# EAGLE design HarvestRing (EAGLE 6.5.0)
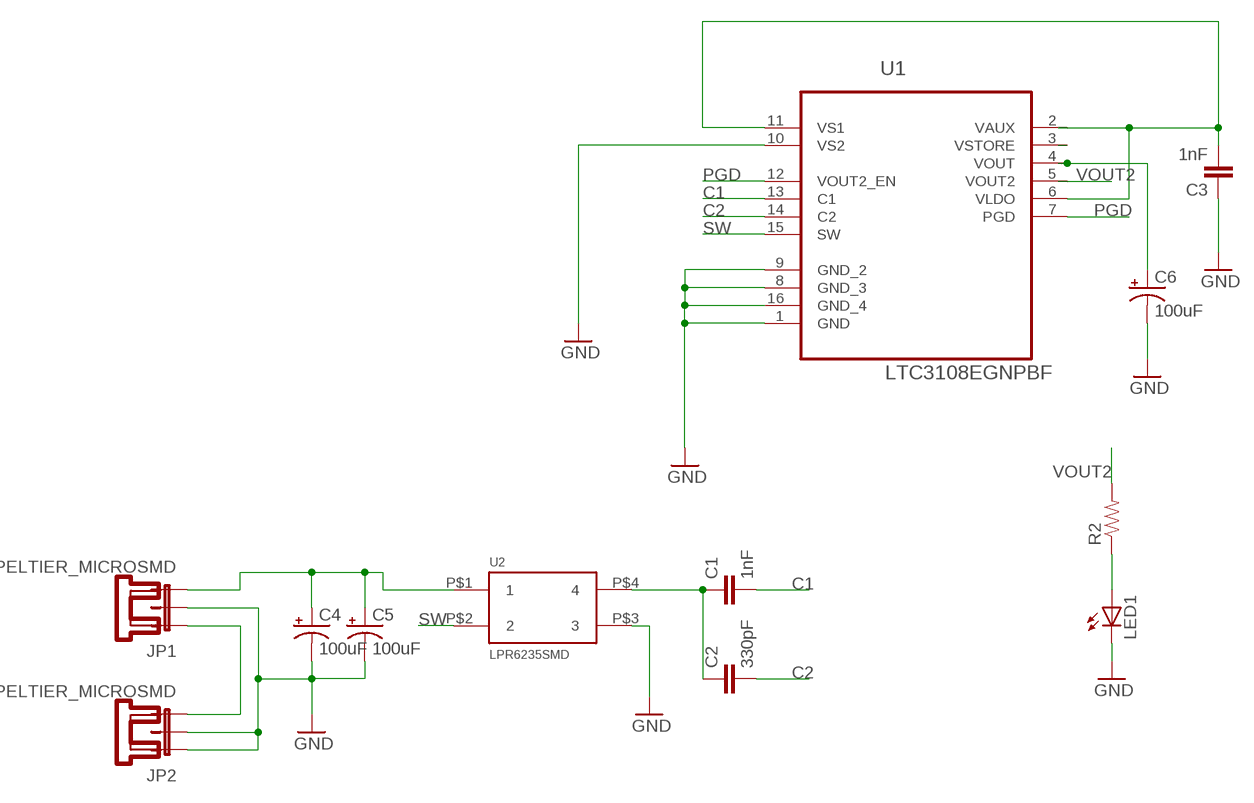
[diagram p0: schematic, sheet 1]

## Parts
C1  1nF  1NF/1000PF-50V-10%(0603)  [0603-CAP]
C2  330pF  22PF-50V-5%(0603)  [0603-CAP]
C3  1nF  1NF/1000PF-50V-10%(0603)  [0603-CAP]
C4  100uF  10UF-TANT  [EIA3216]
C5  100uF  10UF-TANT  [EIA3216]
C6  100uF  10UF-TANT  [EIA3216]
JP1  PELTIER_MICROSMD  [HV56]
JP2  PELTIER_MICROSMD  [HV56]
LED1  LED1206  [LED-1206]
R2  22K  22KOHM1/10W1%(0603)  [0603-RES]
U1  LTC3108EGNPBF  [SOP63P600X175-16N]
U2  LPR6235SMD  [LPR6235]

## Nets
C1: C1.2 U1.13(C1)
C2: C2.2 U1.14(C2)
GND: C3.1 C4.C(-) C5.C(-) C6.C(-) JP1.2 JP2.1 JP2.2 LED1.C U1.1(GND) U1.8(GND_3) U1.9(GND_2) U1.10(VS2) U1.16(GND_4) U2.P$3
N$1: C1.1 C2.1 U2.P$4
N$2: C4.A(+) C5.A(+) JP1.3 U2.P$1
N$3: JP1.1 JP2.3
N$4: C3.2 U1.2(VAUX) U1.6(VLDO) U1.11(VS1)
N$5: C6.A(+) U1.4(VOUT)
N$6: LED1.A R2.1
N$7: U1.3(VSTORE)
PGD: U1.7(PGD) U1.12(VOUT2_EN)
SW: U1.15(SW) U2.P$2
VOUT2: R2.2 U1.5(VOUT2)

## Library data of the parts
C1 C3 = SparkFun-Capacitors:1NF/1000PF-50V-10%(0603): CAP-07886; PROD_ID: CAP-07886
C2 = SparkFun-Capacitors:22PF-50V-5%(0603): CAP-07876; PROD_ID: CAP-07876; VALUE: 22pF
C4-C6 = SparkFun-Capacitors:10UF-TANT: 10uF Tantalum SMT CAP-00811- 16V 10% (EIA-3216); PROD_ID: CAP-00811; VALUE: 10uF
JP1 JP2 = IdleHandsProject:PELTIER_MICRO
LED1 = anoven:LED: LEDs Standard schematic elements and footprints for 5mm, 3mm, 1210, 1206, and 0603 sized LEDs.
R2 = SparkFun-Resistors:22KOHM1/10W1%(0603): RES-07853; PROD_ID: RES-07853
U1 = LTC_By_element14_Batch_1:LTC3108EGNPBF: Ultralow Voltage Step-Up Converter and Power Manager; MPN: LTC3108EGN#PBF; OC_FARNELL: 1839133; OC_NEWARK: 67R4278; PACKAGE: SSOP-16; SUPPLIER: Linear Technology
U2 = inductor-coilcraft-2:LPR6235: Miniature Step-Up Flyback Transformers – LPR6235 http://www.coilcraft.com/lpr6235.cfm

## Board
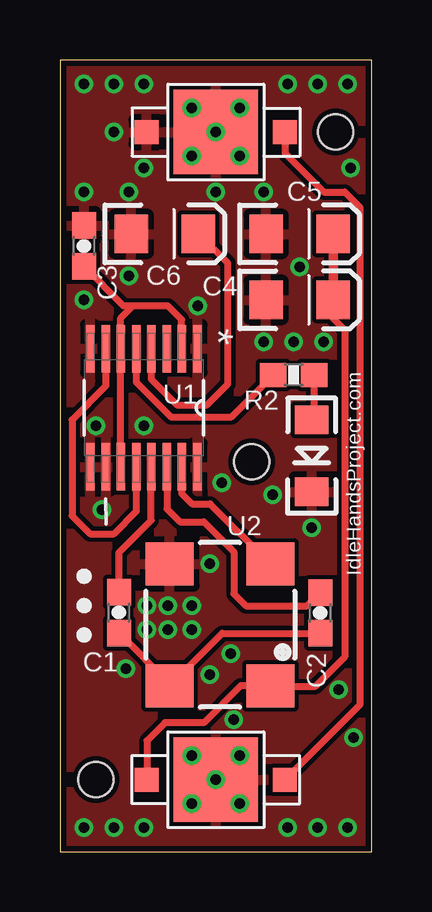
[diagram p1: board, top side]
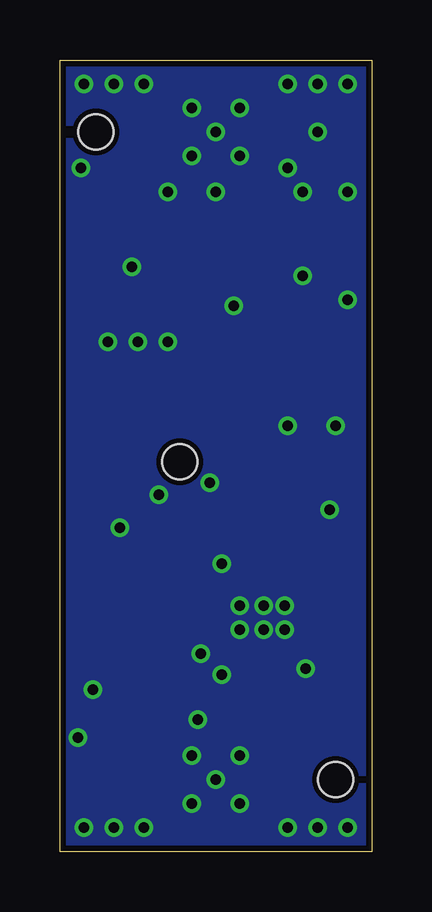
[diagram p2: board, bottom side, seen from below]

Size 13 x 33 mm. Coordinates in mm from the lower left corner, seen from the top.
Outline: 0,0 13,0 13,33 0,33 0,0
Copper layers (1*16): Top 0.0356mm / dielectric 1.5011mm / Bottom 0.0356mm
Design rules "LaenPCBOrder *": minimum track width 6mil, minimum drill 13mil, track to track 7mil, track to pad 7mil, pad to pad 7mil, via to via 7mil, smd to smd 7mil, copper to edge 10mil, drill to drill 6mil, minimum pad ring 7mil, minimum via ring 7mil, stop-mask expansion 3mil, vias tented up to drill 0mil, thermal gap 10mil
Holes 1.45 mm at 1.5,3 11.5,30 8,16.25

### Footprints (pad centres in the part's own frame; a part is rotated, then mirrored left to right if it is on the bottom)
0603-CAP = smd 1.1 x 1: 1 -0.85,0; 2 0.85,0
EIA3216 = smd 1.4 x 1.6: A 1.4,0; C -1.4,0
HV56 = smd 1 x 1: 1 -2.889,0; 3 2.889,0 | smd 3.54 x 3.54: 2 0,0
LED-1206 = smd 1.2 x 1.4: A -1.5,0; C 1.5,0
0603-RES = smd 1.1 x 1: 1 -0.85,0; 2 0.85,0
SOP63P600X175-16N = smd 1.981 x 0.356: 1 -2.464,2.235; 2 -2.464,1.575; 3 -2.464,0.965; 4 -2.464,0.305; 5 -2.464,-0.305; 6 -2.464,-0.965; 7 -2.464,-1.575; 8 -2.464,-2.235; 9 2.464,-2.235; 10 2.464,-1.575; 11 2.464,-0.965; 12 2.464,-0.305; 13 2.464,0.305; 14 2.464,0.965; 15 2.464,1.575; 16 2.464,2.235
LPR6235 = smd 2 x 1.8: P$1 1.27,6.35; P$2 1.27,1.27; P$3 5.47,1.27; P$4 5.47,6.35

### Placement (x,y rotation side)
C1  2.46,9.96 90 top
C2  10.86,9.95 90 top
C3  1,25.25 270 top
C4  10,23 0 top
C5  10,25.75 0 top
C6  4.38,25.75 0 top
JP1  6.5,3 180 top
JP2  6.5,30 0 top
LED1  10.5,16.5 270 top
R2  9.75,19.88 180 top
U1  3.5,18.5 270 top
U2  10.05,13.26 180 top
U$1  [ELIPSISLOGO-3MM]  3.6,7.75 90 top

### Tracks (layer width: path | path; a pad name or v marks a point on that pad's centre or on a via)
C1
  Top 0.3: C1.2 2.46,12.46 3.81,13.8 U1.13
C2
  Top 0.3: U1.14 4.46,14.29 5,13.75 6,13.75 7.25,12.5 7.25,10.75 7.75,10.25 10.31,10.25 C2.2
GND  (via drill 0.43)
  other vias: 1.5,17.75 1.75,14.25 4.5,10.25 5.5,10.25 4.5,9.25 2.88,24 1,27.5 1,23 8.5,27.5 1,32 2.25,32 3.5,32 12,32 9.5,32 1,1 2.25,1 3.5,1 9.5,1 10.75,1 12,1 8.88,14.88 10.5,13.5 3.5,17.75 10.75,32 2.25,30 3.5,28.5 8.5,21.25 9.75,21.25 11,21.25 2.88,27.5 5.75,22.75 6.75,15.38 6.5,3 7.5,4 5.5,4 5.5,2 7.5,2 6.5,30 5.5,29 7.5,29 7.5,31 5.5,31 6.25,12 5.5,9.25 6.5,27.5 7.25,5.5 7.12,8.25 6.25,7.38 2.75,7.62 11.62,6.75 12.25,4.75 10,24.38 12.12,28.5 3.62,10.25 3.62,9.25
  pour Top: 0,32.9 13,32.9 13,0 0,0
  pour Bottom: 0,33 13,33 13,0 0,0
  cutout Top: 8.38,30.88 9.88,30.88 9.88,29.12 8.38,29.12
  cutout Top: 3.12,3.88 4.62,3.88 4.62,2.12 3.12,2.12
N$1
  Top 0.3: U2.P$4 6.77,9.1 C2.1 | C1.1 4.58,6.99
  Top 0.4: 4.58,6.99 U2.P$4
N$2
  Top 0.3: C4.A 11.4,22.23 11.88,21.75 11.88,8.12 10.62,6.88 8.81,6.88 U2.P$1 7.54,6.91 6,5.38 4.38,5.38 3.62,4.62 3.62,3.01 JP1.3
  Top 0.4: 9.39,6.3 U2.P$1 | C4.A C5.A
N$3
  Top 0.3: JP1.1 12.5,6.11 12.5,26.88 11.88,27.5 11,27.5 9.39,29.11 JP2.3
N$4
  Top 0.3: U1.11 U1.6 2.54,22.25 3.04,22.75 | U1.2 5.08,22.18 4.5,22.75 3.04,22.75 | 3.04,22.75 2.65,22.75 C3.2
N$5
  Top 0.3: U1.4 3.81,19.7 4.88,18.62 6.12,18.62 7,19.5 7,24.52 C6.A
N$6
  Top 0.3: R2.1 10.6,18.1 LED1.A
PGD
  Top 0.3: U1.7 1.93,19.43 0.5,18 0.5,14 1.25,13.25 2.25,13.25 3.19,14.2 U1.12
SW
  Top 0.3: U1.15 5.08,14.93 5.5,14.5 6.27,14.5 U2.P$2
VOUT2
  Top 0.3: U1.5 3.19,19.55 4.62,18.12 7.15,18.12 R2.2

### Text on the board
tPlace: IdleHandsProject.com
tValues: + | +